# Altium schematic sheet ejemplo_disparo.SchDoc
size 127 x 101 mm
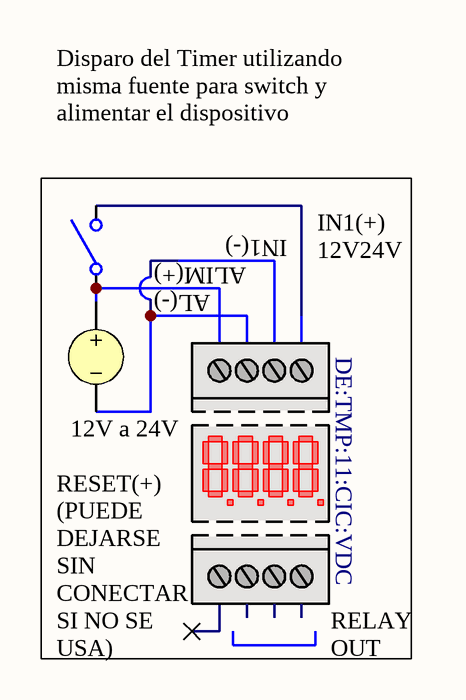
[diagram p0: ejemplo_disparo.SchDoc]

## Parts
SW?  SW  [PULSADOR200TH]  (value not drawn)
V?  VSRC  (value not drawn)

## Nets

Not connected (* = marked no-connect by the designer): SW? 1 2; V? 1 2

## Notes on the sheet
- (near SW?) Disparo del Timer utilizando misma fuente para switch y alimentar el dispositivo
- IN1(-)
- AL(-)
- ALIM(+)
- DE:TMP:11:CIC:VDC
- IN1(+) 12V24V
- (near V?) RESET(+) (PUEDE DEJARSE SIN CONECTAR SI NO SE USA)
- (near V?) 12V a 24V
- RELAY OUT

## Library data of the parts
SW? = SW: Switch; Price: ?
V? = VSRC: Voltage Source; Note: PCB Footprint - Not required; Published: 8-Jun-2000; LatestRevisionDate: 17-Jul-2002; LatestRevisionNote: Re-released for DXP Platform.; PackageReference: Not Applicable; Publisher: Altium Limited